# EAGLE design Rollbot (EAGLE 9.6.2)
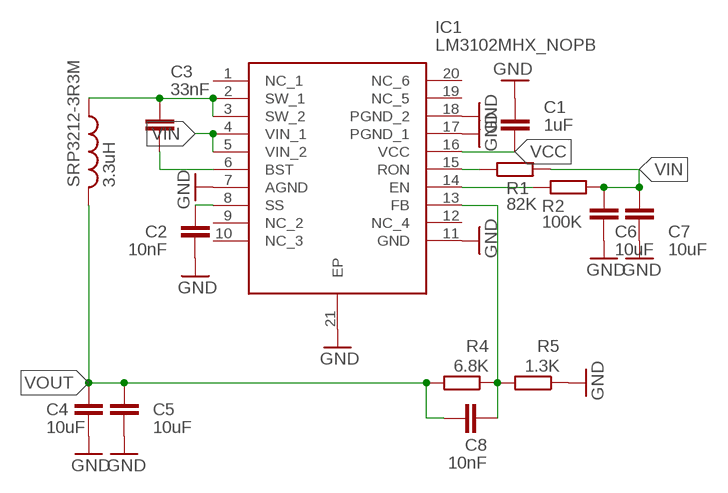
[diagram p0: schematic, sheet 1]

## Parts
C1  1uF  C-EUC0603  [C0603]
C2  10nF  C-EUC0603  [C0603]
C3  33nF  C-EUC0603  [C0603]
C4  10uF  C-EUC0603  [C0603]
C5  10uF  C-EUC0603  [C0603]
C6  10uF  C-EUC0603  [C0603]
C7  10uF  C-EUC0603  [C0603]
C8  10nF  C-EUC0603  [C0603]
IC1  LM3102MHX_NOPB  [SOP65P640X110-21N]
R1  82K  R-EU_R0603  [R0603]
R2  100K  R-EU_R0603  [R0603]
R4  6.8K  R-EU_R0603  [R0603]
R5  1.3K  R-EU_R0603  [R0603]
SRP3212-3R3M  3.3uH  SRP3212  [SRP3212]

## Nets
GND: C1.1 C2.1 C4.2 C5.2 C6.2 C7.2 IC1.7(AGND) IC1.11(GND) IC1.17(PGND_1) IC1.18(PGND_2) IC1.21(EP) R5.1
N$1: IC1.14(EN) R2.1
N$2: C3.1 IC1.2(SW_1) IC1.3(SW_2) SRP3212-3R3M.P$1
N$4: C8.2 IC1.13(FB) R4.1 R5.2
N$6: C3.2 IC1.6(BST)
N$8: C2.2 IC1.8(SS)
RON: IC1.15(RON) R1.1
VCC: C1.2 IC1.16(VCC)
VIN: C6.1 C7.1 IC1.4(VIN_1) IC1.5(VIN_2) R1.2 R2.2
VOUT: C4.1 C5.1 C8.1 R4.2 SRP3212-3R3M.P$2
Unconnected: IC1.1(NC_1) IC1.9(NC_2) IC1.10(NC_3) IC1.12(NC_4) IC1.19(NC_5) IC1.20(NC_6)

## Library data of the parts
C1-C8 = rcl:C-EU: CAPACITOR, European symbol; SPICEPREFIX: C
IC1 = SamacSys_Parts:LM3102MHX_NOPB: SIMPLE SWITCHER Synchronous 1MHz 2.5A Step-Down Voltage Regulator Source: Datasheet <http://www.ti.com/lit/gpn/lm3102>; ARROW_PART_NUMBER: LM3102MHX/NOPB; ARROW_PRICE-STOCK: https://www.arrow.com/en/products/lm3102mhxnopb/texas-instruments?region=nac; DESCRIPTION: SIMPLE SWITCHER Synchronous 1MHz 2.5A Step-Down Voltage Regulator; HEIGHT: 1.1mm; MANUFACTURER_NAME: Texas Instruments; MANUFACTURER_PART_NUMBER: LM3102MHX/NOPB; MOUSER_PART_NUMBER: 926-LM3102MHX/NOPB; MOUSER_PRICE-STOCK: https://www.mouser.co.uk/ProductDetail/Texas-Instruments/LM3102MHX-NOPB?qs=X1J7HmVL2ZETSIWAkLrLGg%3D%3D
R1 R2 R4 R5 = rcl:R-EU_: RESISTOR, European symbol; SPICEPREFIX: R
SRP3212-3R3M = Customized_components:SRP3212

## Module PD_AMP
Ports: 

### Library data of the parts

## Board
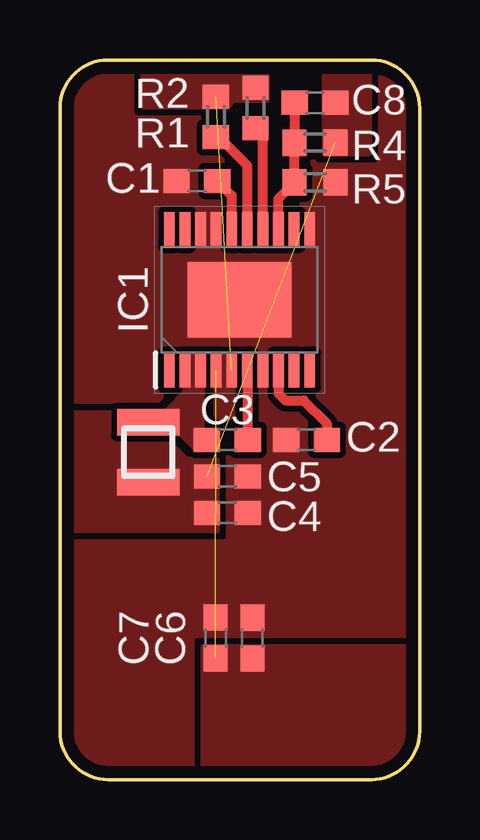
[diagram p1: board, top side]

Size 15 x 30 mm. Coordinates in mm from the lower left corner, seen from the top.
Outline: 0,28 0,2 arc90 2,0 13,0 arc90 15,2 15,28 arc90 13,30 2,30 arc90 0,28
Copper layers (1*16): Top 0.035mm / dielectric 0.73mm / Bottom 0.035mm
Design rules "Wegstr_1oz": minimum track width 6mil, minimum drill 0.4mm, track to track 0.15mm, track to pad 0.15mm, pad to pad 0.15mm, via to via 0.15mm, smd to smd 0mil, copper to edge 0.5mm, drill to drill 0.5mm, minimum pad ring 0.28mm, minimum via ring 0.28mm, stop-mask expansion 0mil, vias tented up to drill 1mil, thermal gap 10mil

### Footprints (pad centres in the part's own frame; a part is rotated, then mirrored left to right if it is on the bottom)
C0603 = smd 1.1 x 1: 1 -0.85,0; 2 0.85,0
SOP65P640X110-21N = smd 1.45 x 0.45: 1 -2.925,2.925; 2 -2.925,2.275; 3 -2.925,1.625; 4 -2.925,0.975; 5 -2.925,0.325; 6 -2.925,-0.325; 7 -2.925,-0.975; 8 -2.925,-1.625; 9 -2.925,-2.275; 10 -2.925,-2.925; 11 2.925,-2.925; 12 2.925,-2.275; 13 2.925,-1.625; 14 2.925,-0.975; 15 2.925,-0.325; 16 2.925,0.325; 17 2.925,0.975; 18 2.925,1.625; 19 2.925,2.275; 20 2.925,2.925 | smd 3.15 x 4.35: 21 0,0
R0603 = smd 1 x 1.1: 1 -0.85,0; 2 0.85,0
SRP3212 = smd 1.1 x 2.6: P$1 -1.25,0; P$2 1.25,0

### Placement (x,y rotation side)
C1  5.71,24.95 0 top
C2  10.29,14.16 0 top
C3  6.98,14.16 0 top
C4  6.99,11.11 0 top
C5  6.99,12.64 0 top
C6  8.03,5.9 90 top
C7  6.5,5.91 90 top
C8  10.64,28.22 180 top
IC1  7.49,20 90 top
R1  6.51,27.62 90 top
R2  8.16,28 90 top
R4  10.64,26.55 0 top
R5  10.64,24.89 180 top
SRP3212-3R3M  3.68,13.65 270 top

### Tracks (layer width: path | path; a pad name or v marks a point on that pad's centre or on a via)
BLOCK
  cutout Top (no thermals): 0.51,15.56 2.39,15.56 2.39,15.51 0.51,15.51
GND
  pour Top (isolate 0.254, rank 6, no thermals): -3,37 17,37 19,35 19,0 16,-3 -1,-3 -4,0 -4,36
N$1
  Top 0.406: IC1.14 8.47,26.84 R2.1
N$2
  pour Top (rank 3, no thermals): 5.21,17.72 5.21,16.19 4.45,15.43 4.45,14.92 5.59,13.78 5.97,13.78 5.97,17.72
N$4
  Top 0.406: IC1.13 9.12,24.22 R5.2 R4.1 C8.2
N$6
  Top 0.406: IC1.6 7.82,14.18 C3.2
N$8
  Top 0.406: IC1.8 9.12,16.09 9.4,15.81 10.16,15.81 11.13,14.84 C2.2
RON
  Top 0.406: IC1.15 7.82,25.59 6.63,26.77 R1.1
VCC
  Top 0.406: C1.2 7.17,24.35 IC1.16
VIN  (2 unrouted)
  pour Top (no thermals): 6.48,17.72 6.48,15.18 6.6,15.05 7.11,15.05 7.24,15.18 7.24,17.72
  pour Top (no thermals): 6,5.54 16,5.54 16,0.54 6,0.54
  pour Top (no thermals): 3.48,28.08 6.99,28.08 7.24,28.34 8.64,28.34 8.64,30.11 3.48,30.11
VOUT  (1 unrouted)
  pour Top (isolate 0.254, rank 4, no thermals): 6.6,15.4 -2.67,15.4 -2.67,10.35 6.6,10.35
  pour Top (no thermals): 11.02,26.12 12.91,26.12 12.91,30.1 11.02,30.1